# Altium schematic sheet MCU.SchDoc: WearTech-MCU_P1
size A4; Revision: 1; SheetNumber: 2; SheetTotal: 3; ProjectName: WearTech
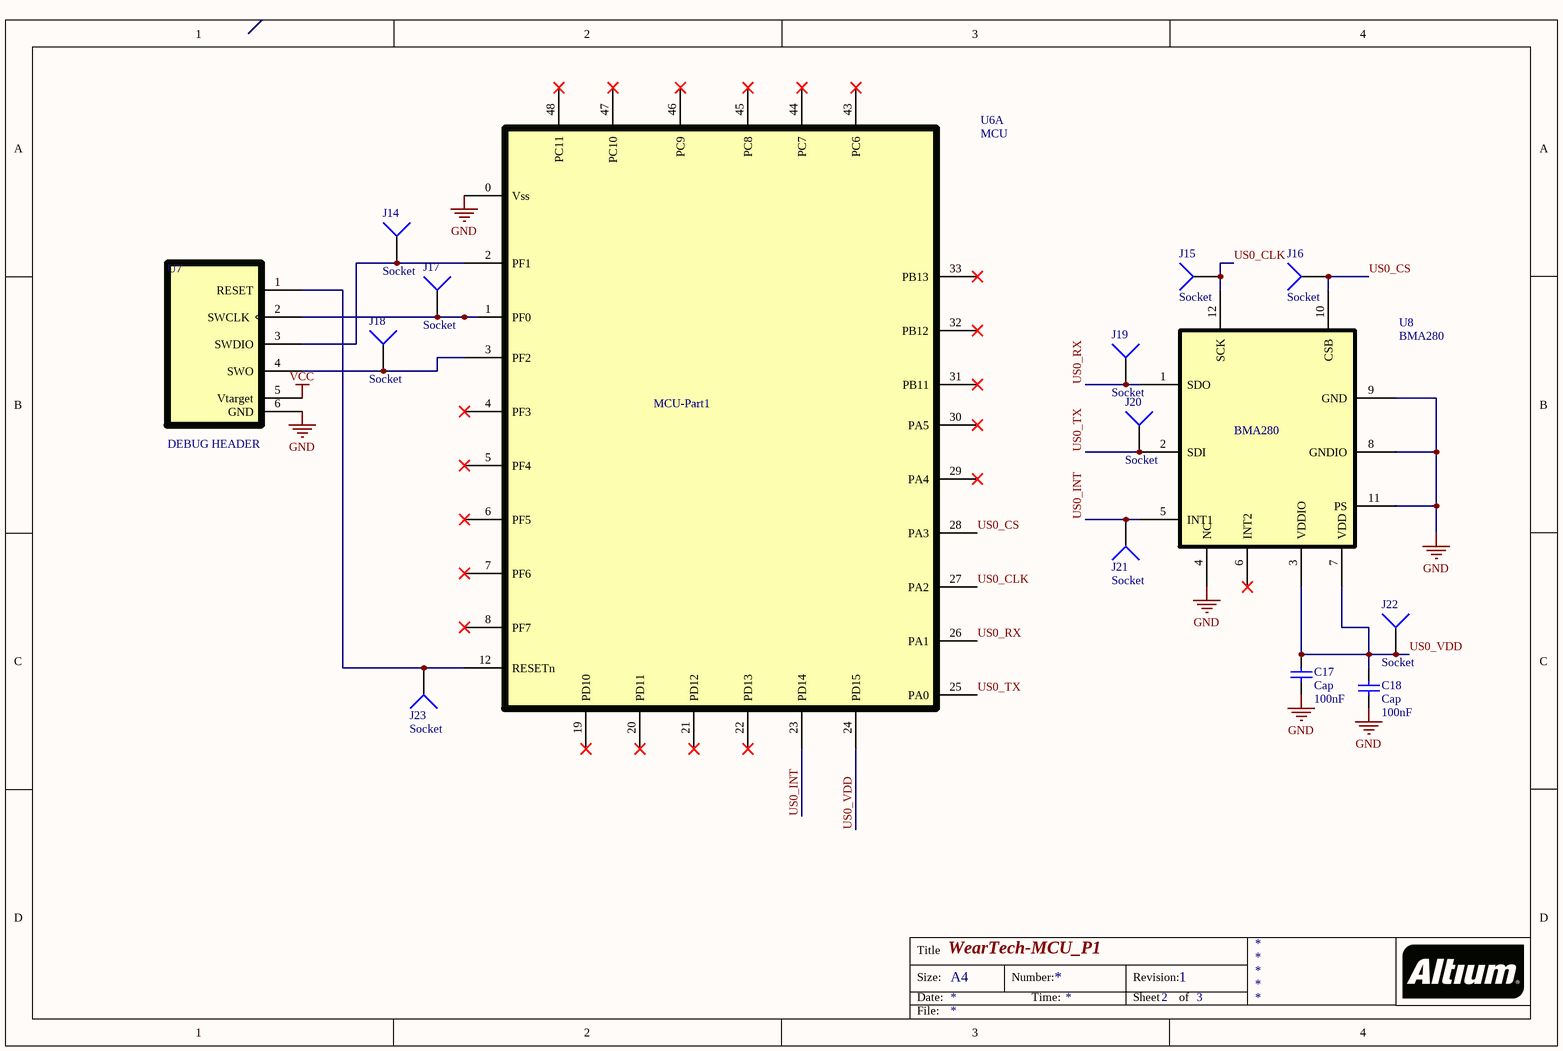
[diagram p0: MCU.SchDoc]

## Parts
C17  Cap  value 100nF  [1608[0603]]
C18  Cap  value 100nF  [1608[0603]]
J14  Socket  [PIN1]
J15  Socket  [PIN1]
J16  Socket  [PIN1]
J17  Socket  [PIN1]
J18  Socket  [PIN1]
J19  Socket  [PIN1]
J20  Socket  [PIN1]
J21  Socket  [PIN1]
J22  Socket  [PIN1]
J23  Socket  [PIN1]
U6  MCU  [QFN50P700X700X90_HS-49N]  (part A of 2)
U7  DEBUG HEADER  [HDR1X6]
U8  BMA280  [QFN50P200X200X100-12N]

## Nets
GND: C17.1 C18.1 U6.0(Vss) U7.6(GND) U8.4(NC) U8.8(GNDIO) U8.9(GND) U8.11(PS)
VCC: U7.5(Vtarget)
US0_CLK: J15.1 U6.27(PA2) U8.12(SCK)
US0_CS: J16.1 U6.28(PA3) U8.10(CSB)
US0_INT: J21.1 U6.23(PD14) U8.5(INT1)
US0_RX: J19.1 U6.26(PA1) U8.1(SDO)
US0_TX: J20.1 U6.25(PA0) U8.2(SDI)
US0_VDD: C17.2 C18.2 J22.1 U6.24(PD15) U8.3(VDDIO) U8.7(VDD)
NetJ14_1: J14.1 U6.2(PF1) U7.3(SWDIO)
NetJ17_1: J17.1 U6.1(PF0) U7.2(SWCLK)
NetJ18_1: J18.1 U6.3(PF2) U7.4(SWO)
NetJ23_1: J23.1 U6.12(RESETn) U7.1(RESET)

Not connected (* = marked no-connect by the designer): U6 4(PF3)* 5(PF4)* 6(PF5)* 7(PF6)* 8(PF7)* 19(PD10)* 20(PD11)* 21(PD12)* 22(PD13)* 29(PA4)* 30(PA5)* 31(PB11)* 32(PB12)* 33(PB13)* 43(PC6)* 44(PC7)* 45(PC8)* 46(PC9)* 47(PC10)* 48(PC11)*; U8 6(INT2)*

## Notes on the sheet
- (near U6) MCU-Part1
- (near U8) BMA280
- Title
- Size:
- Date:
- A4
- Number:
- Time:
- Revision:
- Sheet
- of
- File:

## Library data of the parts
C17 C18 = Cap: CAP CER 0.1UF 16V X7R 0603; Manufacturer: Murata Electronics North America; Manufacturer Part Number: GRM188R71C104KA01D; Digikey Part Number: 490-1532-1-ND; ComponentLink1URL: http://search.murata.co.jp/Ceramy/image/img/A01X/G101/ENG/GRM188R71C104KA01-01.pdf; ComponentLink1Description: Datasheet
J14-J23 = Socket: Manufacturer: Amphenol FCI; Manufacturer Part Number: 68000-200HLF; Description: BERGSTRIP .100" DR STRAIGHT; Digikey Part Number: 609-5099-1-ND; ComponentLink1URL: http://cdn.amphenol-icc.com/media/wysiwyg/files/drawing/68000.pdf; ComponentLink1Description: Datasheet
U6 = MCU: RF System on a Chip - SoC Blue Premium 19dBm 2.4G 512kB 64kB(RAM); Manufacturer: Silicon Labs; Manufacturer Part Number: EFR32BG13P732F512GM48-C; Mouser Part Number: 634-EFR32BG13P732-C; ComponentLink1URL: http://www.mouser.com/ds/2/368/efr32bg13-datasheet-1114948.pdf; ComponentLink1Description: Datasheet
U7 = DEBUG HEADER: BERGSTRIP .100" DR STRAIGHT; Manufacturer: Amphenol FCI; Manufacturer Part Number: 68000-200HLF; Digikey Part Number: 609-5099-1-ND; ComponentLink1URL: http://cdn.amphenol-icc.com/media/wysiwyg/files/drawing/68000.pdf; ComponentLink1Description: ComponentLink1Description
U8 = BMA280: Accelerometers 3-Axis 2x2mm LGA-12 2g-16g prog 14-bit; Manufacturer: Bosch Sensortec; Manufacturer Part Number: BMA280; Mouser Part Number: 262-BMA280; ComponentLink1URL: http://www.mouser.com/ds/2/783/BST-BMA280-DS000-11_published-786496.pdf; ComponentLink1Description: Datasheet